# Altium project Spartan3_TestBoard.PrjPcb
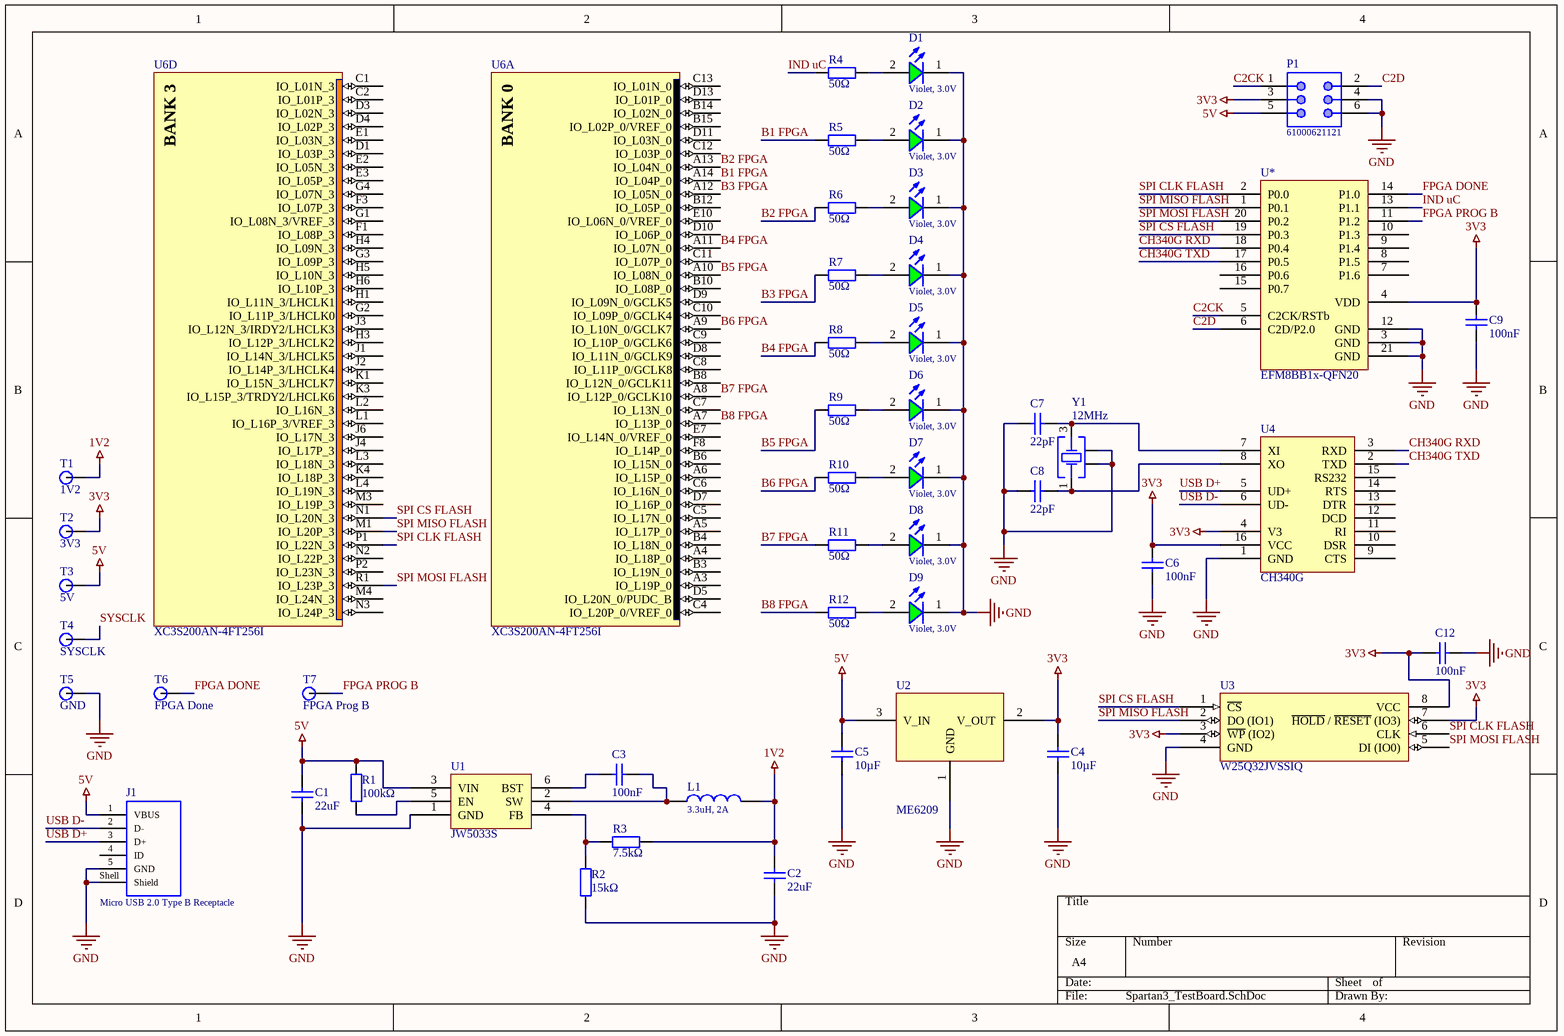
[diagram p0: Spartan3_TestBoard.SchDoc]
3 sheets, 78 parts. Net scope: global (net labels, ports and power ports of the same name join across sheets).
Board file: Spartan3_TestBoard.PcbDoc
Sheets:
  Spartan3_TestBoard.SchDoc
  Spartan3_TestBoard_2.SchDoc
  Spartan3_TestBoard_3.SchDoc

## Sheet Spartan3_TestBoard.SchDoc
size A4; SheetNumber: 1; SheetTotal: 3

### Parts
C1  22uF  [WCAP-CSGP_0805_H=0.8mm_Reflow]
C2  22uF  [WCAP-CSGP_0805_H=0.8mm_Reflow]
C3  100nF  [WCAP-CSGP_0402]
C4  10µF  [WCAP-CSGP_0402]
C5  10µF  [WCAP-CSGP_0402]
C6  100nF  [WCAP-CSGP_0402]
C7  22pF  [WCAP-CSGP_0402]
C8  22pF  [WCAP-CSGP_0402]
C9  100nF  [WCAP-CSGP_0402]
C12  100nF  [WCAP-CSGP_0402]
D1  Violet, 3.0V  [WL-SMCW_0603_H=0.7mm]
D2  Violet, 3.0V  [WL-SMCW_0603_H=0.7mm]
D3  Violet, 3.0V  [WL-SMCW_0603_H=0.7mm]
D4  Violet, 3.0V  [WL-SMCW_0603_H=0.7mm]
D5  Violet, 3.0V  [WL-SMCW_0603_H=0.7mm]
D6  Violet, 3.0V  [WL-SMCW_0603_H=0.7mm]
D7  Violet, 3.0V  [WL-SMCW_0603_H=0.7mm]
D8  Violet, 3.0V  [WL-SMCW_0603_H=0.7mm]
D9  Violet, 3.0V  [WL-SMCW_0603_H=0.7mm]
J1  Micro USB 2.0 Type B Receptacle  [629105136821]
L1  3.3uH, 2A  [WE-PD2_5848]
P1  61000621121  [61000621121]
R1  100kΩ  [WRIS-PSMB_0805_H=0.35mm]
R2  15kΩ  [WRIS-PSMB_0805_H=0.35mm]
R3  7.5kΩ  [WRIS-PSMB_0805_H=0.35mm]
R4  50Ω  [WRIS-PSMB_0805_H=0.35mm]
R5  50Ω  [WRIS-PSMB_0805_H=0.35mm]
R6  50Ω  [WRIS-PSMB_0805_H=0.35mm]
R7  50Ω  [WRIS-PSMB_0805_H=0.35mm]
R8  50Ω  [WRIS-PSMB_0805_H=0.35mm]
R9  50Ω  [WRIS-PSMB_0805_H=0.35mm]
R10  50Ω  [WRIS-PSMB_0805_H=0.35mm]
R11  50Ω  [WRIS-PSMB_0805_H=0.35mm]
R12  50Ω  [WRIS-PSMB_0805_H=0.35mm]
T1  1V2  [Testpoint]
T2  3V3  [Testpoint]
T3  5V  [Testpoint]
T4  SYSCLK  [Testpoint]
T5  GND  [Testpoint]
T6  FPGA Done  [Testpoint]
T7  FPGA Prog B  [Testpoint]
U1  JW5033S  [SOT95P280X110-6N]
U2  ME6209  [SOT95P285X150-3N]
U3  W25Q32JVSSIQ  [W25Q32JVSSIQ]
U4  CH340G  [CH340G]
U6  XC3S200AN-4FT256I  [XC3S200AN-4FT256I]  (parts A,D of 8)
U*  EFM8BB1x-QFN20  [*QFN50P300X300X80-21N]
Y1  12MHz  [WE-XTAL_CFPX-180]

### Nets
1V2: C2.2 L1.2 R3.2 T1.1
3V3: C4.2 C6.2 C9.1 C12.1 P1.3 T2.1 U2.2(V_OUT) U3.3(~{WP}_(IO2)) U3.7(~{HOLD}_/_~{RESET}_(IO3)) U3.8(VCC) U4.4(V3) U4.16(VCC) U*.4(VDD)
5V: C1.2 C5.2 J1.1(VBUS) P1.5 R1.1 T3.1 U1.3(VIN) U2.3(V_IN)
GND: C1.1 C2.1 C4.1 C5.1 C6.1 C7.2 C8.2 C9.2 C12.2 D1.1(K) D2.1(K) D3.1(K) D4.1(K) D5.1(K) D6.1(K) D7.1(K) D8.1(K) D9.1(K) J1.5(GND) J1.Shell(Shield) P1.4 P1.6 R2.1 T5.1 U1.1(GND) U2.1(GND) U3.4(GND) U4.1(GND) U*.3(GND) U*.12(GND) U*.21(GND) Y1.2(GND) Y1.4(GND)
B1 FPGA: R5.1 U6.A14(IO_L04P_0)
B2 FPGA: R6.1 U6.A13(IO_L04N_0)
B3 FPGA: R7.1 U6.A12(IO_L05N_0)
B4 FPGA: R8.1 U6.A11(IO_L07N_0)
B5 FPGA: R9.1 U6.A10(IO_L08N_0)
B6 FPGA: R10.1 U6.A9(IO_L10N_0/GCLK7)
B7 FPGA: R11.1 U6.A8(IO_L12P_0/GCLK10)
B8 FPGA: R12.1 U6.A7(IO_L13P_0)
C2CK: P1.1 U*.5(C2CK/RSTb)
C2D: P1.2 U*.6(C2D/P2.0)
CH340G RXD: U4.3(RXD) U*.18(P0.4)
CH340G TXD: U4.2(TXD) U*.17(P0.5)
FPGA DONE: T6.1 U*.14(P1.0)
FPGA PROG B: T7.1 U*.11(P1.2)
IND uC: R4.1 U*.13(P1.1)
SPI CLK FLASH: U3.6(CLK) U6.P1(IO_L22N_3) U*.2(P0.0)
SPI CS FLASH: U3.1(~{CS}) U6.N1(IO_L20N_3) U*.19(P0.3)
SPI MISO FLASH: U3.2(DO_(IO1)) U6.M1(IO_L20P_3) U*.1(P0.1)
SPI MOSI FLASH: U3.5(DI_(IO0)) U6.R1(IO_L23P_3) U*.20(P0.2)
SYSCLK: T4.1
USB D+: J1.3(D+) U4.5(UD+)
USB D-: J1.2(D-) U4.6(UD-)
NetC3_1: C3.1 L1.1 U1.2(SW)
NetC3_2: C3.2 U1.6(BST)
NetC7_1: C7.1 U4.7(XI) Y1.3(Crystal)
NetC8_1: C8.1 U4.8(XO) Y1.1(Crystal)
NetD1_2: D1.2(A) R4.2
NetD2_2: D2.2(A) R5.2
NetD3_2: D3.2(A) R6.2
NetD4_2: D4.2(A) R7.2
NetD5_2: D5.2(A) R8.2
NetD6_2: D6.2(A) R9.2
NetD7_2: D7.2(A) R10.2
NetD8_2: D8.2(A) R11.2
NetD9_2: D9.2(A) R12.2
NetR1_2: R1.2 U1.5(EN)
NetR2_2: R2.2 R3.1 U1.4(FB)

Not connected (* = marked no-connect by the designer): J1 4(ID); U4 9(CTS) 10(DSR) 11(RI) 12(DCD) 13(DTR) 14(RTS) 15(RS232); U6 A3(IO_L19P_0) A4(IO_L18P_0) A5(IO_L17P_0) A6(IO_L15P_0) B3(IO_L19N_0) B4(IO_L18N_0) B6(IO_L15N_0) B8(IO_L12N_0/GCLK11) B10(IO_L08P_0) B12(IO_L05P_0) B14(IO_L02N_0) B15(IO_L02P_0/VREF_0) C1(IO_L01N_3) C2(IO_L01P_3) C4(IO_L20P_0/VREF_0) C5(IO_L17N_0) C6(IO_L16N_0) C7(IO_L13N_0) C8(IO_L11P_0/GCLK8) C9(IO_L10P_0/GCLK6) C10(IO_L09P_0/GCLK4) C11(IO_L07P_0) C12(IO_L03P_0) C13(IO_L01N_0) D1(IO_L03P_3) D3(IO_L02N_3) D4(IO_L02P_3) D5(IO_L20N_0/PUDC_B) D7(IO_L16P_0) D8(IO_L11N_0/GCLK9) D9(IO_L09N_0/GCLK5) D10(IO_L06P_0) D11(IO_L03N_0) D13(IO_L01P_0) E1(IO_L03N_3) E2(IO_L05N_3) E3(IO_L05P_3) E7(IO_L14N_0/VREF_0) E10(IO_L06N_0/VREF_0) F1(IO_L08P_3) F3(IO_L07P_3) F8(IO_L14P_0) G1(IO_L08N_3/VREF_3) G2(IO_L11P_3/LHCLK0) G3(IO_L09P_3) G4(IO_L07N_3) H1(IO_L11N_3/LHCLK1) H3(IO_L12P_3/LHCLK2) H4(IO_L09N_3) H5(IO_L10N_3) H6(IO_L10P_3) J1(IO_L14N_3/LHCLK5) J2(IO_L14P_3/LHCLK4) J3(IO_L12N_3/IRDY2/LHCLK3) J4(IO_L17P_3) J6(IO_L17N_3) K1(IO_L15N_3/LHCLK7) K3(IO_L15P_3/TRDY2/LHCLK6) K4(IO_L18P_3) L1(IO_L16P_3/VREF_3) L2(IO_L16N_3) L3(IO_L18N_3) L4(IO_L19N_3) M3(IO_L19P_3) M4(IO_L24N_3) N2(IO_L22P_3) N3(IO_L24P_3) P2(IO_L23N_3); U* 7(P1.6) 8(P1.5) 9(P1.4) 10(P1.3) 15(P0.7) 16(P0.6)

### Notes on the sheet
- (in symbol XC3S200AN-4FT256I, part A) BANK 0
- (in symbol XC3S200AN-4FT256I, part D) BANK 3

### Library data of the parts
C1 C2 = 885012007022: WCAP-CSGP General Purpose Ceramic Capacitors, size 0805, 1.5nF, +/-5%, 16VDC; Isolation Resistance: >=10GOhm; Ceramic Type: NP0; Dissipation Factor: Q>=1000; Technical Reference: NP00805152J016DFCT10000; ComponentLink1Description: Manufacturer; ComponentLink1URL: http://www.we-online.de; ComponentLink2Description: Datasheet; ComponentLink2URL: https://katalog.we-online.com/pbs/datasheet/885012007022.pdf; Operating Temperature: -55 to +125degC; Packaging: Tape and Reel; Part Number: 885012007022; Publisher: Wurth Elektronik; Rated Voltage: 16VDC; Published Date: August 2019; Capacitance Tolerance: +/-5%; Height: 0.8mm +/-0.10mm; Mounting Technology: SMD; Size: 0805; Capacitance: 1.5nF
C3-C9 C12 = 885012205018: WCAP-CSGP General Purpose Ceramic Capacitors, size 0402, 100nF, +/-10%, 10VDC; Isolation Resistance: >=5GOhm; Ceramic Type: X7R; Technical Reference: X7R0402104K010DFCT10000; ComponentLink1Description: Manufacturer; ComponentLink1URL: http://www.we-online.de; ComponentLink2Description: Datasheet; ComponentLink2URL: https://katalog.we-online.com/pbs/datasheet/885012205018.pdf; Operating Temperature: -55 to +125degC; Packaging: Tape and Reel; Part Number: 885012205018; Publisher: Wurth Elektronik; Rated Voltage: 10VDC; Published Date: August 2019; Capacitance Tolerance: +/-10%; Dissipation Factor: =<5%; Height: 0.5mm +/-0.05mm; Mounting Technology: SMD; Size: 0402; Capacitance: 100nF
D1-D9 = 150060GS75000: WL-SMCW SMT Mono-color Chip LED Waterclear, size 0603, Green, 3.2V, 140deg; Chip Technology: InGaN; Dominant Wavelength typ.: 525nm; Luminous Intensity typ.: 430mcd; Peak Wavelength typ.: 515nm; Viewing Angle: 140deg; ComponentLink1Description: Manufacturer; ComponentLink1URL: http://www.we-online.de; ComponentLink2URL: https://www.we-online.com/catalog/datasheet/150060GS75000.pdf; ComponentLink2Description: Datasheet; Forward Voltage typ.: 3.2V; Emitting Color: Green; Mounting Technology: SMT; Operating Temperature: -40 to +85degC; Published Date: December 2019; Part Number: 150060GS75000; Packaging: Tape and Reel; Size: 0603; Publisher: Wurth Elektronik
J1 = 629105136821: Micro USB 2.0 Type B, Receptacle, Horizontal, SMT; Manufacturer: Wurth Elektronik; Rated Current: 1A; Pin Number: 5; Interface Type: Type B; Working Voltage: 30VAC; ComponentLink1Description: Manufacturer; ComponentLink1URL: http://www.we-online.de; ComponentLink2Description: Datasheet; ComponentLink2URL: https://katalog.we-online.com/em/datasheet/629105136821.pdf; Published Date: August 2020; Manufacturer Part Number: 629105136821; Gender: Receptacle; Type: Horizontal; Packaging: Tape and Reel; Operating Temperature: -40 to +105degC; Mounting Technology: SMT; Application: Micro USB 2.0
L1 = 744774033: WE-PD2 SMT Power Inductor, size 5848, 3.3uH, 4A; Manufacturer: Wurth Elektronik; Self Resonant Frequency: 43MHz; DC Resistance max.: 0.06Ohm; DC Resistance typ.: 0.042Ohm; Saturation Current: 7.5A; ComponentLink1Description: Manufacturer; ComponentLink1URL: http://www.we-online.de; ComponentLink2Description: Datasheet; ComponentLink2URL: https://www.we-online.com/catalog/datasheet/744774033.pdf; Packaging: Tape and Reel; Published Date: April 2020; Rated Current: 4A; Operating Temperature: -40 to +125degC; Size: 5848; Inductance: 3.3uH; Mounting Technology: SMT; Manufacturer Part Number: 744774033
P1 = 61000621121: WR-PHD Pin Header, SMT, pitch 2.54mm, Dual Row, Vertical, 6p; Manufacturer: Wurth Elektronik; Pin Number: 6; Rated Current: 3A; Working Voltage: 250VAC; Withstanding Voltage: 500VAC; Contact Resistance: 20mOhm; ComponentLink1Description: Manufacturer; ComponentLink1URL: http://www.we-online.de; ComponentLink2Description: Datasheet; ComponentLink2URL: https://www.we-online.com/catalog/datasheet/61000621121.pdf; Manufacturer Part Number: 61000621121; Published Date: May 2020; Pitch: 2.54mm; Operating Temperature: -40 to +125degC; Mounting Technology: SMT; Packaging: Tube; Gender: Pin Header; Row Number: Dual; Orientation: Vertical
R1-R12 = 580060720003: WRIS-PSMB Metal Plate Resistors, size 0805, 5mOhm, +/-1%, 0.5W; Rated Current: 10A; Temperature Coefficient of Resistance: +/-100ppm/degC; Technical Reference: MB0805R005F102KAATP0000; ComponentLink1Description: Manufacturer; ComponentLink1URL: http://www.we-online.de; ComponentLink2Description: Datasheet; ComponentLink2URL: https://katalog.we-online.com/pbs/datasheet/580060720003.pdf; Publisher: Wurth Elektronik; Rated Power: 0.5W; Resistance: 5mOhm; Mounting Technology: SMT; Height: 0.35mm; Part Number: 580060720003; Packaging: Tape and Reel; Published Date: September 2019; Size: 0805; Length: 2mm; Operating Temperature: -55 to +155degC; Resistance Tolerance: +/-1%; Width: 1.25mm
T1-T7 = Testpoint
U1 = JW5033S: 2A Step-Down Converter
U3 = W25Q32JVSSIQ: IC FLASH 32MBIT SPI/QUAD 8SOIC
U6 = XC3S200AN-4FT256I: Spartan-3AN Non-Volatile FPGA, 195 User I/Os, 256-Pin FTBGA, Standard Performance, Industrial Grade; Code_JEDEC: MS-034-AAF-1*; PackageVersion: ver1.3, Oct-2007; PackageReference: FT256; PackageDescription: 256-Ball Fine Pitch Thin Ball Grid Array 1.00 mm Pitch (FT256); DatasheetVersion: ver 3.2, Nov-2009; PartNumber: XC3S200AN-4FT256I
Y1 = 830055295: WE-XTAL Quartz Crystal, SMT, CFPX-180, 12MHz, +/-20ppm; Manufacturer: Wurth Elektronik; Frequency Stability: +/-30ppm; Load Capacitance: 18pF; ComponentLink1Description: Manufacturer; ComponentLink1URL: http://www.we-online.de; ComponentLink2Description: Datasheet; ComponentLink2URL: https://katalog.we-online.com/pbs/datasheet/830055295.pdf; Operating Temperature: -40 to +85degC; Packaging: Tape and Reel; Manufacturer Part Number: 830055295; Published Date: July 2020; Size: CFPX-180; Frequency: 12MHz; Frequency Tolerance: +/-20ppm; Mounting Technology: SMT

## Sheet Spartan3_TestBoard_2.SchDoc
size A4; SheetNumber: 2; SheetTotal: 3
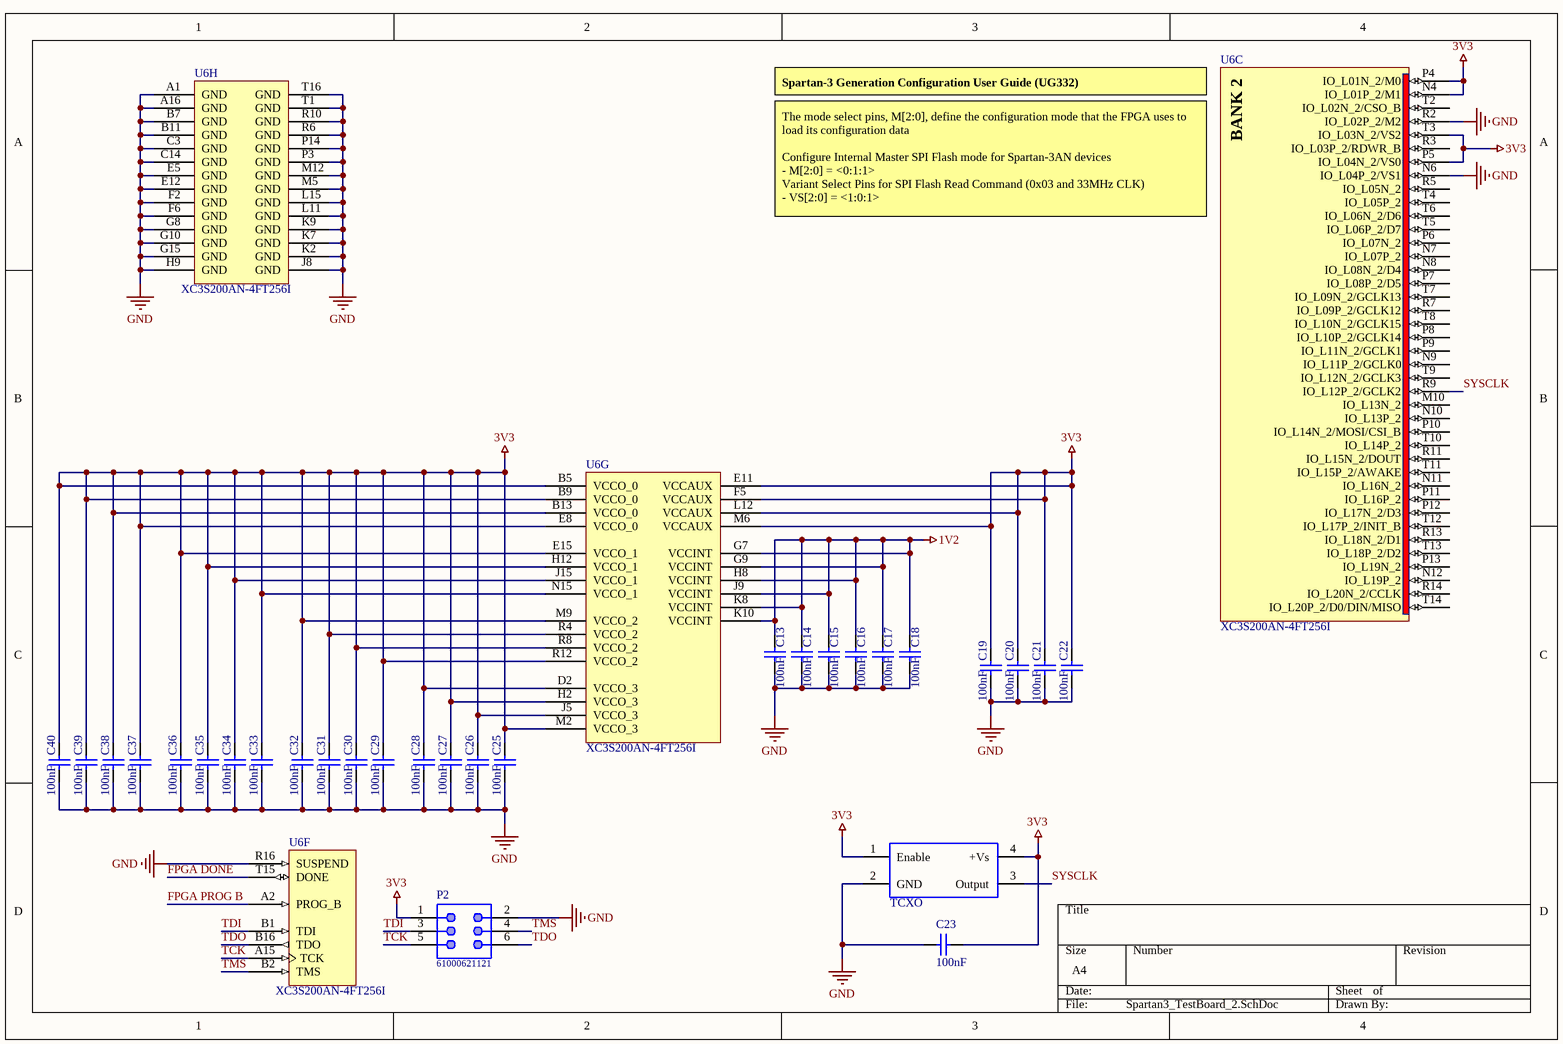
[diagram p1: Spartan3_TestBoard_2.SchDoc]

### Parts
C13  100nF  [WCAP-CSGP_0402]
C14  100nF  [WCAP-CSGP_0402]
C15  100nF  [WCAP-CSGP_0402]
C16  100nF  [WCAP-CSGP_0402]
C17  100nF  [WCAP-CSGP_0402]
C18  100nF  [WCAP-CSGP_0402]
C19  100nF  [WCAP-CSGP_0402]
C20  100nF  [WCAP-CSGP_0402]
C21  100nF  [WCAP-CSGP_0402]
C22  100nF  [WCAP-CSGP_0402]
C23  100nF  [WCAP-CSGP_0402]
C25  100nF  [WCAP-CSGP_0402]
C26  100nF  [WCAP-CSGP_0402]
C27  100nF  [WCAP-CSGP_0402]
C28  100nF  [WCAP-CSGP_0402]
C29  100nF  [WCAP-CSGP_0402]
C30  100nF  [WCAP-CSGP_0402]
C31  100nF  [WCAP-CSGP_0402]
C32  100nF  [WCAP-CSGP_0402]
C33  100nF  [WCAP-CSGP_0402]
C34  100nF  [WCAP-CSGP_0402]
C35  100nF  [WCAP-CSGP_0402]
C36  100nF  [WCAP-CSGP_0402]
C37  100nF  [WCAP-CSGP_0402]
C38  100nF  [WCAP-CSGP_0402]
C39  100nF  [WCAP-CSGP_0402]
C40  100nF  [WCAP-CSGP_0402]
P2  61000621121  [61000621121]
TCXO  12MHz, +/-50ppm, 3.3V  [WE-SPXO_CFPS-39]  (value not drawn)
U6  XC3S200AN-4FT256I  [XC3S200AN-4FT256I]  (parts C,F,G,H of 8)

### Nets
1V2: C13.1 C14.1 C15.1 C16.1 C17.1 C18.1 U6.G7(VCCINT) U6.G9(VCCINT) U6.H8(VCCINT) U6.J9(VCCINT) U6.K8(VCCINT) U6.K10(VCCINT)
3V3: C19.2 C20.2 C21.2 C22.2 C23.1 C25.2 C26.2 C27.2 C28.2 C29.2 C30.2 C31.2 C32.2 C33.2 C34.2 C35.2 C36.2 C37.2 C38.2 C39.2 C40.2 P2.1 TCXO.1(Enable) TCXO.4(+Vs) U6.B5(VCCO_0) U6.B9(VCCO_0) U6.B13(VCCO_0) U6.D2(VCCO_3) U6.E8(VCCO_0) U6.E11(VCCAUX) U6.E15(VCCO_1) U6.F5(VCCAUX) U6.H2(VCCO_3) U6.H12(VCCO_1) U6.J5(VCCO_3) U6.J15(VCCO_1) U6.L12(VCCAUX) U6.M2(VCCO_3) U6.M6(VCCAUX) U6.M9(VCCO_2) U6.N4(IO_L01P_2/M1) U6.N15(VCCO_1) U6.P4(IO_L01N_2/M0) U6.P5(IO_L04N_2/VS0) U6.R4(VCCO_2) U6.R8(VCCO_2) U6.R12(VCCO_2) U6.T3(IO_L03N_2/VS2)
GND: C13.2 C14.2 C15.2 C16.2 C17.2 C18.2 C19.1 C20.1 C21.1 C22.1 C23.2 C25.1 C26.1 C27.1 C28.1 C29.1 C30.1 C31.1 C32.1 C33.1 C34.1 C35.1 C36.1 C37.1 C38.1 C39.1 C40.1 P2.2 TCXO.2(GND) U6.A1(GND) U6.A16(GND) U6.B7(GND) U6.B11(GND) U6.C3(GND) U6.C14(GND) U6.E5(GND) U6.E12(GND) U6.F2(GND) U6.F6(GND) U6.G8(GND) U6.G10(GND) U6.G15(GND) U6.H9(GND) U6.J8(GND) U6.K2(GND) U6.K7(GND) U6.K9(GND) U6.L11(GND) U6.L15(GND) U6.M5(GND) U6.M12(GND) U6.N6(IO_L04P_2/VS1) U6.P3(GND) U6.P14(GND) U6.R2(IO_L02P_2/M2) U6.R6(GND) U6.R10(GND) U6.R16(SUSPEND) U6.T1(GND) U6.T16(GND)
FPGA DONE: U6.T15(DONE)
FPGA PROG B: U6.A2(PROG_B)
SYSCLK: TCXO.3(Output) U6.R9(IO_L12P_2/GCLK2)
TCK: P2.5 U6.A15(TCK)
TDI: P2.3 U6.B1(TDI)
TDO: P2.6 U6.B16(TDO)
TMS: P2.4 U6.B2(TMS)

Not connected (* = marked no-connect by the designer): U6 M10(IO_L13N_2) N7(IO_L07P_2) N8(IO_L08N_2/D4) N9(IO_L11P_2/GCLK0) N10(IO_L13P_2) N11(IO_L16N_2) N12(IO_L19P_2) P6(IO_L07N_2) P7(IO_L08P_2/D5) P8(IO_L10P_2/GCLK14) P9(IO_L11N_2/GCLK1) P10(IO_L14N_2/MOSI/CSI_B) P11(IO_L16P_2) P12(IO_L17N_2/D3) P13(IO_L19N_2) R3(IO_L03P_2/RDWR_B) R5(IO_L05N_2) R7(IO_L09P_2/GCLK12) R11(IO_L15N_2/DOUT) R13(IO_L18N_2/D1) R14(IO_L20N_2/CCLK) T2(IO_L02N_2/CSO_B) T4(IO_L05P_2) T5(IO_L06P_2/D7) T6(IO_L06N_2/D6) T7(IO_L09N_2/GCLK13) T8(IO_L10N_2/GCLK15) T9(IO_L12N_2/GCLK3) T10(IO_L14P_2) T11(IO_L15P_2/AWAKE) T12(IO_L17P_2/INIT_B) T13(IO_L18P_2/D2) T14(IO_L20P_2/D0/DIN/MISO)

### Notes on the sheet
- Spartan-3 Generation Configuration User Guide (UG332)
- The mode select pins, M[2:0], define the configuration mode that the FPGA uses to
  load its configuration data
  Configure Internal Master SPI Flash mode for Spartan-3AN devices
  - M[2:0] = <0:1:1>
  Variant Select Pins for SPI Flash Read Command (0x03 and 33MHz CLK)
  - VS[2:0] = <1:0:1>
- (in symbol XC3S200AN-4FT256I, part C) BANK 2

### Library data of the parts
C13-C23 C25-C40 = 885012205018: as C3 on sheet Spartan3_TestBoard; ComponentLink1Description: Manufacturer; ComponentLink1URL: http://www.we-online.de; ComponentLink2Description: Datasheet; ComponentLink2URL: https://katalog.we-online.com/pbs/datasheet/885012205018.pdf; Operating Temperature: -55 to +125degC; Packaging: Tape and Reel; Part Number: 885012205018; Publisher: Wurth Elektronik; Rated Voltage: 10VDC; Published Date: August 2019; Capacitance Tolerance: +/-10%; Dissipation Factor: =<5%; Height: 0.5mm +/-0.05mm; Mounting Technology: SMD; Size: 0402; Capacitance: 100nF
P2 = 61000621121: as P1 on sheet Spartan3_TestBoard; ComponentLink1Description: Manufacturer; ComponentLink1URL: http://www.we-online.de; ComponentLink2Description: Datasheet; ComponentLink2URL: https://www.we-online.com/catalog/datasheet/61000621121.pdf; Manufacturer Part Number: 61000621121; Published Date: May 2020; Pitch: 2.54mm; Operating Temperature: -40 to +125degC; Mounting Technology: SMT; Packaging: Tube; Gender: Pin Header; Row Number: Dual; Orientation: Vertical
TCXO = 831025492: WE-SPXO Simple Packaged Quartz Oscillator, size CFPS-39, 12MHz, +/-50ppm, 3.3V; Frequency Stability: 50ppm; ComponentLink1Description: Manufacturer; ComponentLink1URL: http://www.we-online.de; ComponentLink2Description: Datasheet; ComponentLink2URL: https://katalog.we-online.com/pbs/datasheet/831025492.pdf; Part Number: 831025492; Published Date: March 2019; Publisher: Wurth Elektronik; Size: CFPS-39; Operating Temperature: -40 up to +85degC; Mounting Technology: SMT; Packaging: Tape and Reel; Supply Voltage: 3.3V; Frequency: 12MHz
U6 = XC3S200AN-4FT256I: as U6 on sheet Spartan3_TestBoard; Code_JEDEC: MS-034-AAF-1*; PackageVersion: ver1.3, Oct-2007; PackageReference: FT256; PackageDescription: 256-Ball Fine Pitch Thin Ball Grid Array 1.00 mm Pitch (FT256); DatasheetVersion: ver 3.2, Nov-2009; PartNumber: XC3S200AN-4FT256I

## Sheet Spartan3_TestBoard_3.SchDoc
size A4; SheetNumber: 3; SheetTotal: 3
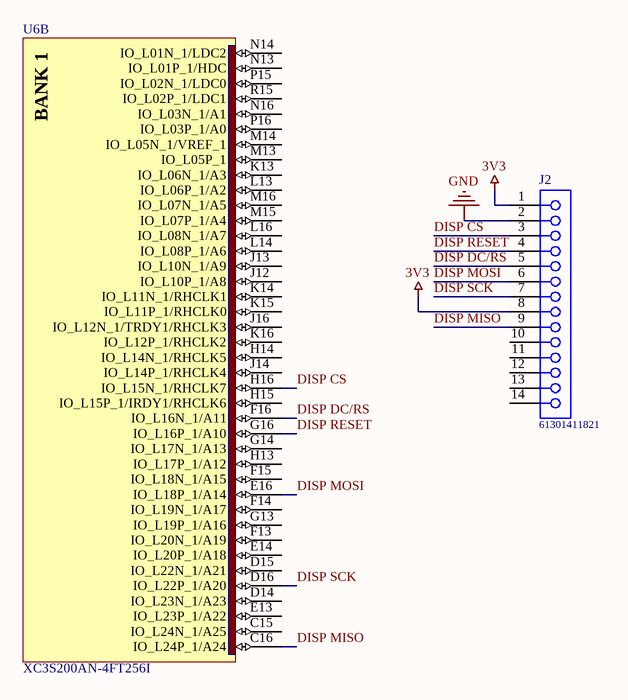
[diagram p2: Spartan3_TestBoard_3.SchDoc]

### Parts
J2  61301411821  [61301411821]
U6  XC3S200AN-4FT256I  [XC3S200AN-4FT256I]  (part B of 8)

### Nets
3V3: J2.1 J2.8
GND: J2.2
DISP CS: J2.3 U6.H16(IO_L15N_1/RHCLK7)
DISP DC/RS: J2.5 U6.F16(IO_L16N_1/A11)
DISP MISO: J2.9 U6.C16(IO_L24P_1/A24)
DISP MOSI: J2.6 U6.E16(IO_L18P_1/A14)
DISP RESET: J2.4 U6.G16(IO_L16P_1/A10)
DISP SCK: J2.7 U6.D16(IO_L22P_1/A20)

Not connected (* = marked no-connect by the designer): J2 10 11 12 13 14; U6 C15(IO_L24N_1/A25) D14(IO_L23N_1/A23) D15(IO_L22N_1/A21) E13(IO_L23P_1/A22) E14(IO_L20P_1/A18) F13(IO_L20N_1/A19) F14(IO_L19N_1/A17) F15(IO_L18N_1/A15) G13(IO_L19P_1/A16) G14(IO_L17N_1/A13) H13(IO_L17P_1/A12) H14(IO_L14N_1/RHCLK5) H15(IO_L15P_1/IRDY1/RHCLK6) J12(IO_L10P_1/A8) J13(IO_L10N_1/A9) J14(IO_L14P_1/RHCLK4) J16(IO_L12N_1/TRDY1/RHCLK3) K13(IO_L06N_1/A3) K14(IO_L11N_1/RHCLK1) K15(IO_L11P_1/RHCLK0) K16(IO_L12P_1/RHCLK2) L13(IO_L06P_1/A2) L14(IO_L08P_1/A6) L16(IO_L08N_1/A7) M13(IO_L05P_1) M14(IO_L05N_1/VREF_1) M15(IO_L07P_1/A4) M16(IO_L07N_1/A5) N13(IO_L01P_1/HDC) N14(IO_L01N_1/LDC2) N16(IO_L03N_1/A1) P15(IO_L02N_1/LDC0) P16(IO_L03P_1/A0) R15(IO_L02P_1/LDC1)

### Notes on the sheet
- (in symbol XC3S200AN-4FT256I, part B) BANK 1

### Library data of the parts
J2 = 61301411821: WR-PHD Socket Header, THT, pitch 2.54mm, Single Row, Vertical, 14p; Manufacturer: Wurth Elektronik; Pin Number: 14; Rated Current: 3A; Working Voltage: 250VAC; Withstanding Voltage: 500VAC; Contact Resistance: 20mOhm; ComponentLink1Description: Manufacturer; ComponentLink1URL: http://www.we-online.de; ComponentLink2Description: Datasheet; ComponentLink2URL: https://www.we-online.com/catalog/datasheet/61301411821.pdf; Manufacturer Part Number: 61301411821; Published Date: May 2020; Pitch: 2.54mm; Operating Temperature: -40 to +125degC; Mounting Technology: THT; Packaging: Tray; Gender: Socket Header; Row Number: Single; Orientation: Vertical
U6 = XC3S200AN-4FT256I: as U6 on sheet Spartan3_TestBoard; Code_JEDEC: MS-034-AAF-1*; PackageVersion: ver1.3, Oct-2007; PackageReference: FT256; PackageDescription: 256-Ball Fine Pitch Thin Ball Grid Array 1.00 mm Pitch (FT256); DatasheetVersion: ver 3.2, Nov-2009; PartNumber: XC3S200AN-4FT256I

## Nets that join several sheets
1V2: Spartan3_TestBoard (C2.2 L1.2 R3.2 T1.1), Spartan3_TestBoard_2 (12 pins)
3V3: Spartan3_TestBoard (13 pins), Spartan3_TestBoard_2 (48 pins), Spartan3_TestBoard_3 (J2.1 J2.8)
GND: Spartan3_TestBoard (33 pins), Spartan3_TestBoard_2 (60 pins), Spartan3_TestBoard_3 (J2.2)
FPGA DONE: Spartan3_TestBoard (T6.1 U*.14), Spartan3_TestBoard_2 (U6.T15)
FPGA PROG B: Spartan3_TestBoard (T7.1 U*.11), Spartan3_TestBoard_2 (U6.A2)
SYSCLK: Spartan3_TestBoard (T4.1), Spartan3_TestBoard_2 (TCXO.3 U6.R9)